# EAGLE design MRCS-SMC-08-Arduino-Relay (EAGLE 7.7.0)
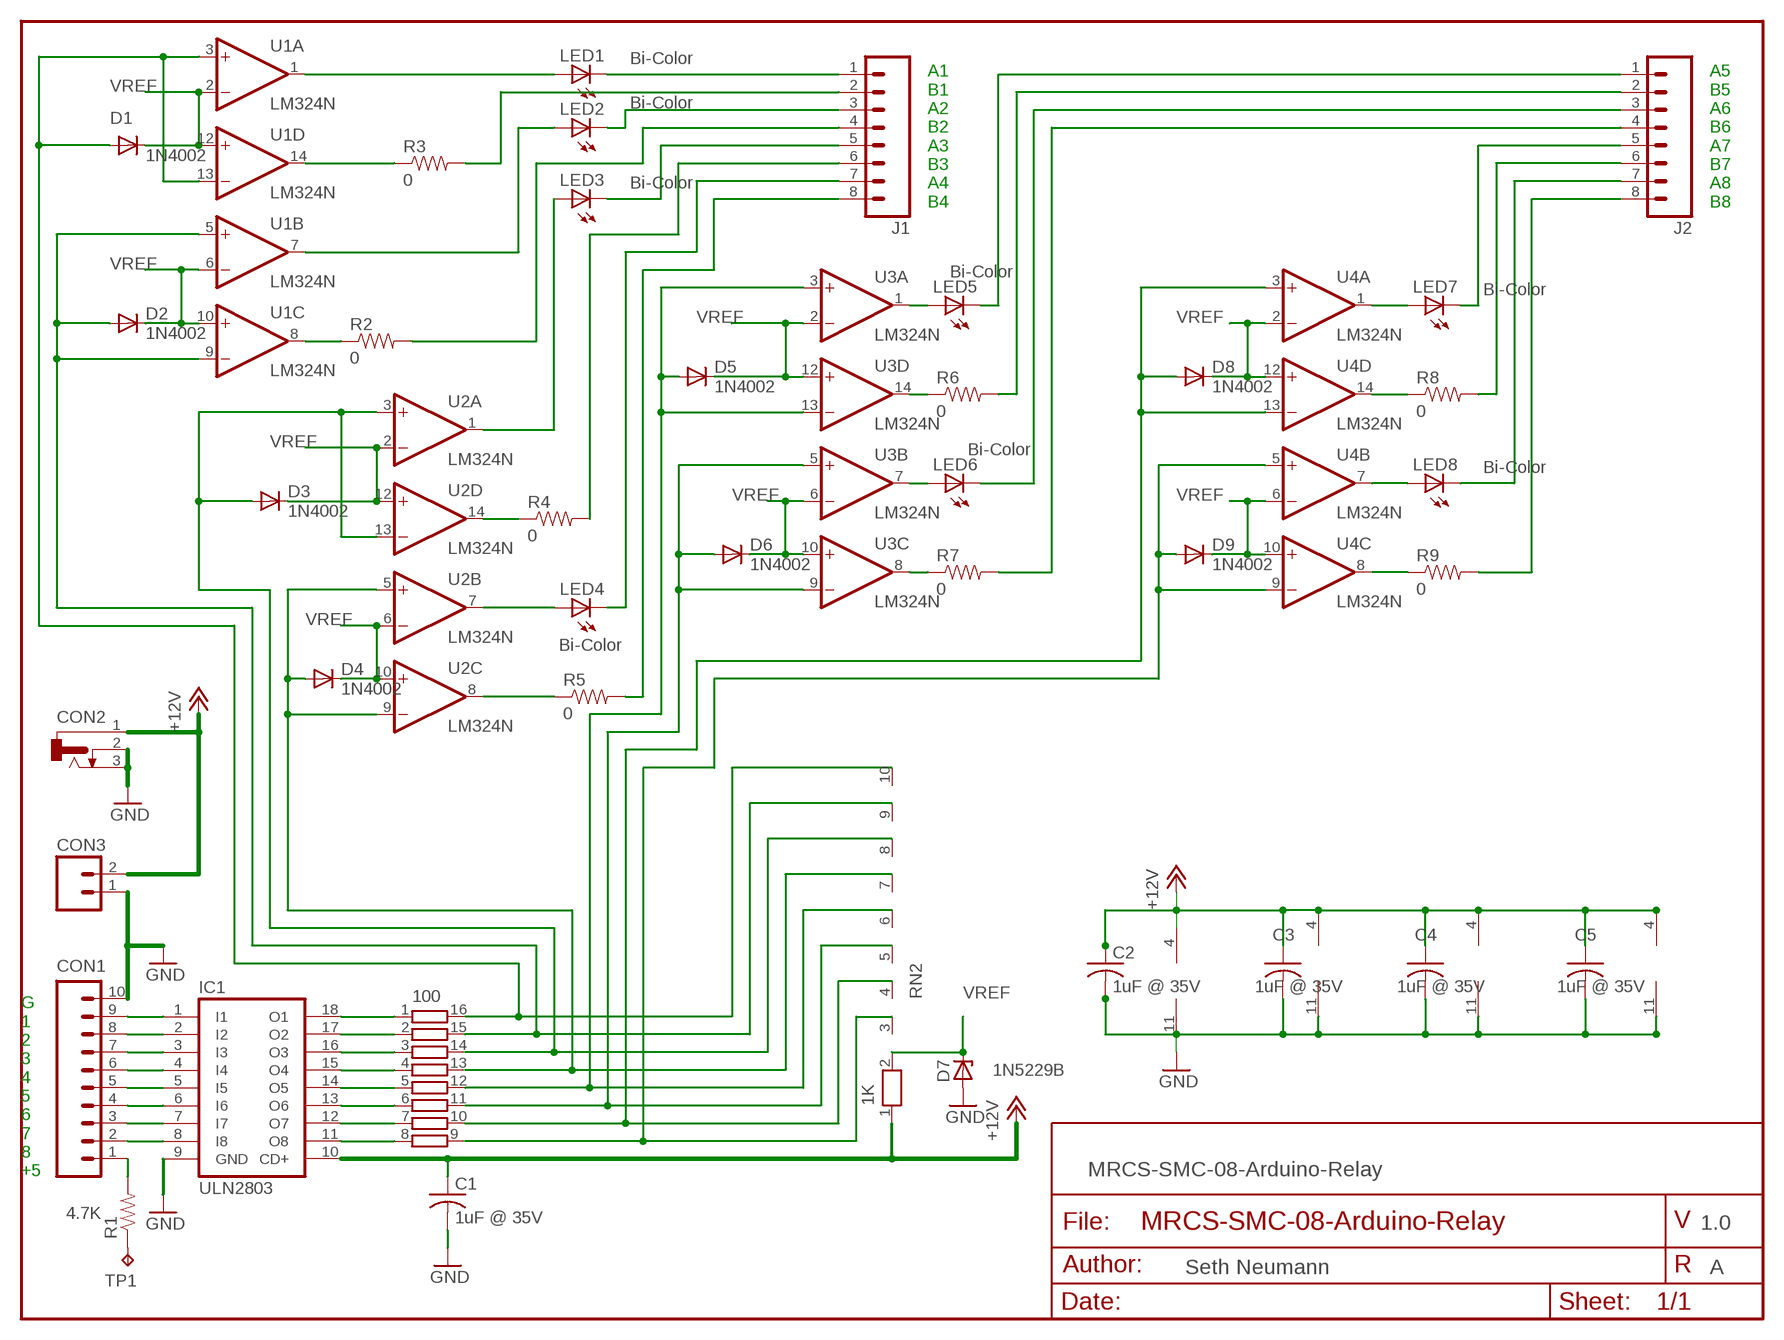
[diagram p0: schematic, sheet 1]

## Parts
C1  1uF @ 35V  CAPPTH2  [C-PTH-0.100]
C2  1uF @ 35V  CAPPTH2  [C-PTH-0.100]
C3  1uF @ 35V  CAPPTH2  [C-PTH-0.100]
C4  1uF @ 35V  CAPPTH2  [C-PTH-0.100]
C5  1uF @ 35V  CAPPTH2  [C-PTH-0.100]
CON1  CONNECTOR-M10LOCK  [1X10_LOCK]
CON2  CONNECTOR-DC-POWER-S  [DCJ0202-SMALL]
CON3  CONNECTOR-M023.5MM-LOCK  [SCREWTERMINAL-3.5MM-2_LOCK]
D1  1N4002  DIODEPTH  [DIODE-1N4001]
D2  1N4002  DIODEPTH  [DIODE-1N4001]
D3  1N4002  DIODEPTH  [DIODE-1N4001]
D4  1N4002  DIODEPTH  [DIODE-1N4001]
D5  1N4002  DIODEPTH  [DIODE-1N4001]
D6  1N4002  DIODEPTH  [DIODE-1N4001]
D7  1N5229B  ZENER-DIODEZD-5  [ZDIO-5]
D8  1N4002  DIODEPTH  [DIODE-1N4001]
D9  1N4002  DIODEPTH  [DIODE-1N4001]
IC1  ULN2803  ULN2803A  [DIL18]
J1  CONNECTOR-M08LOCK  [1X08_LOCK]
J2  CONNECTOR-M08LOCK  [1X08_LOCK]
LED1  Bi-Color  LEDLED3MM  [LED3MM]
LED2  Bi-Color  LEDLED3MM  [LED3MM]
LED3  Bi-Color  LEDLED3MM  [LED3MM]
LED4  Bi-Color  LEDLED3MM  [LED3MM]
LED5  Bi-Color  LEDLED3MM  [LED3MM]
LED6  Bi-Color  LEDLED3MM  [LED3MM]
LED7  Bi-Color  LEDLED3MM  [LED3MM]
LED8  Bi-Color  LEDLED3MM  [LED3MM]
R1  4.7K  RPTH04  [AXIAL-0.4-RES]
R2  0  RPTH-R0  [CUT-R]
R3  0  RPTH-R0  [CUT-R]
R4  0  RPTH-R0  [CUT-R]
R5  0  RPTH-R0  [CUT-R]
R6  0  RPTH-R0  [CUT-R]
R7  0  RPTH-R0  [CUT-R]
R8  0  RPTH-R0  [CUT-R]
R9  0  RPTH-R0  [CUT-R]
RN1  100  8R-N  [DIL16]
RN2  1K  RN09  [RN-10]
TP1  TPPAD1-13  [P1-13]
U1  LM324N  [DIL14]
U2  LM324N  [DIL14]
U3  LM324N  [DIL14]
U4  LM324N  [DIL14]

## Nets
+12V: C1.1 C2.1 C3.1 C4.1 C5.1 CON2.1 CON3.2(B) IC1.10(CD+) RN2.1 U1.4(P:V+) U2.4(P:V+) U3.4(P:V+) U4.4(P:V+)
GND: C1.2 C2.2 C3.2 C4.2 C5.2 CON1.10 CON2.2 CON2.3 CON3.1(A) D7.A IC1.9(GND) U1.11(P:V-) U2.11(P:V-) U3.11(P:V-) U4.11(P:V-)
N$1: R1.P$1 TP1.TP
N$2: CON1.9 IC1.1(I1)
N$3: CON1.8 IC1.2(I2)
N$4: CON1.7 IC1.3(I3)
N$5: CON1.6 IC1.4(I4)
N$6: CON1.5 IC1.5(I5)
N$7: CON1.4 IC1.6(I6)
N$8: CON1.3 IC1.7(I7)
N$9: CON1.2 IC1.8(I8)
N$10: D2.A RN1.15 RN2.9 U1.5(B:+IN) U1.9(C:-IN)
N$11: R3.P2 U1.14(D:OUT)
N$12: CON1.1 R1.P$2
N$13: J1.7 LED4.K(C)
N$14: J1.2 R3.P1
N$15: LED1.A U1.1(A:OUT)
N$16: J1.1 LED1.K(C)
N$17: IC1.18(O1) RN1.1
N$18: IC1.17(O2) RN1.2
N$19: LED2.A U1.7(B:OUT)
N$20: R2.P2 U1.8(C:OUT)
N$21: J1.4 R2.P1
N$22: J1.3 LED2.K(C)
N$23: IC1.16(O3) RN1.3
N$24: IC1.15(O4) RN1.4
N$25: IC1.14(O5) RN1.5
N$26: IC1.13(O6) RN1.6
N$27: IC1.12(O7) RN1.7
N$28: IC1.11(O8) RN1.8
N$29: LED7.A U4.1(A:OUT)
N$30: R8.P2 U4.14(D:OUT)
N$31: D6.A RN1.11 RN2.5 U3.5(B:+IN) U3.9(C:-IN)
N$32: LED5.A U3.1(A:OUT)
N$33: LED4.A U2.7(B:OUT)
N$34: LED3.A U2.1(A:OUT)
N$35: D3.A RN1.14 RN2.8 U2.3(A:+IN) U2.13(D:-IN)
N$36: J1.5 LED3.K(C)
N$37: D1.A RN1.16 RN2.10 U1.3(A:+IN) U1.13(D:-IN)
N$38: R4.P2 U2.14(D:OUT)
N$39: J1.6 R4.P1
N$40: D4.A RN1.13 RN2.7 U2.5(B:+IN) U2.9(C:-IN)
N$41: R5.P2 U2.8(C:OUT)
N$42: J1.8 R5.P1
N$43: R6.P2 U3.14(D:OUT)
N$44: D5.A RN1.12 RN2.6 U3.3(A:+IN) U3.13(D:-IN)
N$45: J2.1 LED5.K(C)
N$46: J2.2 R6.P1
N$47: LED6.A U3.7(B:OUT)
N$48: R7.P2 U3.8(C:OUT)
N$49: J2.3 LED6.K(C)
N$50: J2.4 R7.P1
N$51: LED8.A U4.7(B:OUT)
N$52: J2.6 R8.P1
N$53: D8.A RN1.10 RN2.4 U4.3(A:+IN) U4.13(D:-IN)
N$54: D9.A RN1.9 RN2.3 U4.5(B:+IN) U4.9(C:-IN)
N$55: R9.P2 U4.8(C:OUT)
N$56: J2.5 LED7.K(C)
N$57: J2.7 LED8.K(C)
N$58: J2.8 R9.P1
VREF: D1.C D2.C D3.C D4.C D5.C D6.C D7.C D8.C D9.C RN2.2 U1.2(A:-IN) U1.6(B:-IN) U1.10(C:+IN) U1.12(D:+IN) U2.2(A:-IN) U2.6(B:-IN) U2.10(C:+IN) U2.12(D:+IN) U3.2(A:-IN) U3.6(B:-IN) U3.10(C:+IN) U3.12(D:+IN) U4.2(A:-IN) U4.6(B:-IN) U4.10(C:+IN) U4.12(D:+IN)

## Notes on the sheet
- A1
  B1
  A2
  B2
  A3
  B3
  A4
  B4
- A5
  B5
  A6
  B6
  A7
  B7
  A8
  B8
- G
  1
  2
  3
  4
  5
  6
  7
  8
  +5
- MRCS-SMC-08-Arduino-Relay
- 1.0
- Seth Neumann | A

## Library data of the parts
C1-C5 = SPCoast:CAP*
CON1 = SPCoast:CONNECTOR-M10: Header 10 Standard 10-pin 0.1" header. Use with straight break away headers (SKU : PRT-00116), right angle break away headers (PRT-00553), swiss pins (PRT-00743), machine pins (PRT-00117), and female headers (PRT-00115).
CON2 = SPCoast:CONNECTOR-DC-POWER: DC POWER JACK
CON3 = SPCoast:CONNECTOR-M02: PHOENIX CONNECTOR
D1-D6 D8 D9 = SPCoast:DIODE: Diode These are standard reverse protection diodes and small signal diodes. SMA package can handle up to about 1A. SOD-323 can handle about 200mA. What the SOD-323 package when ordering, there are some mfgs out there that are 5-pin packages.
D7 = SPCoast:ZENER-DIODE: Z-Diode
IC1 = MRCS:ULN2803A: DRIVER ARRAY
J1 J2 = SPCoast:CONNECTOR-M08: Header 8 Standard 8-pin 0.1" header. Use with straight break away headers (SKU : PRT-00116), right angle break away headers (PRT-00553), swiss pins (PRT-00743), machine pins (PRT-00117), and female headers (PRT-00115).
LED1-LED8 = SPCoast:LED*
R1-R9 = SPCoast:R*: Resistor Basic schematic elements and footprints for 0603, 1206, and PTH 1/10th watt (small) resistors.
RN1 = resistor-dil:8R-N: DIL RESISTOR; OC_FARNELL: unknown; OC_NEWARK: unknown
RN2 = MRCS:RN09: RESISTOR NETWORK; OC_FARNELL: unknown; OC_NEWARK: unknown
TP1 = testpad:TP: Test pad
U1-U4 = SPCoast:LM324: OP AMP

## Board
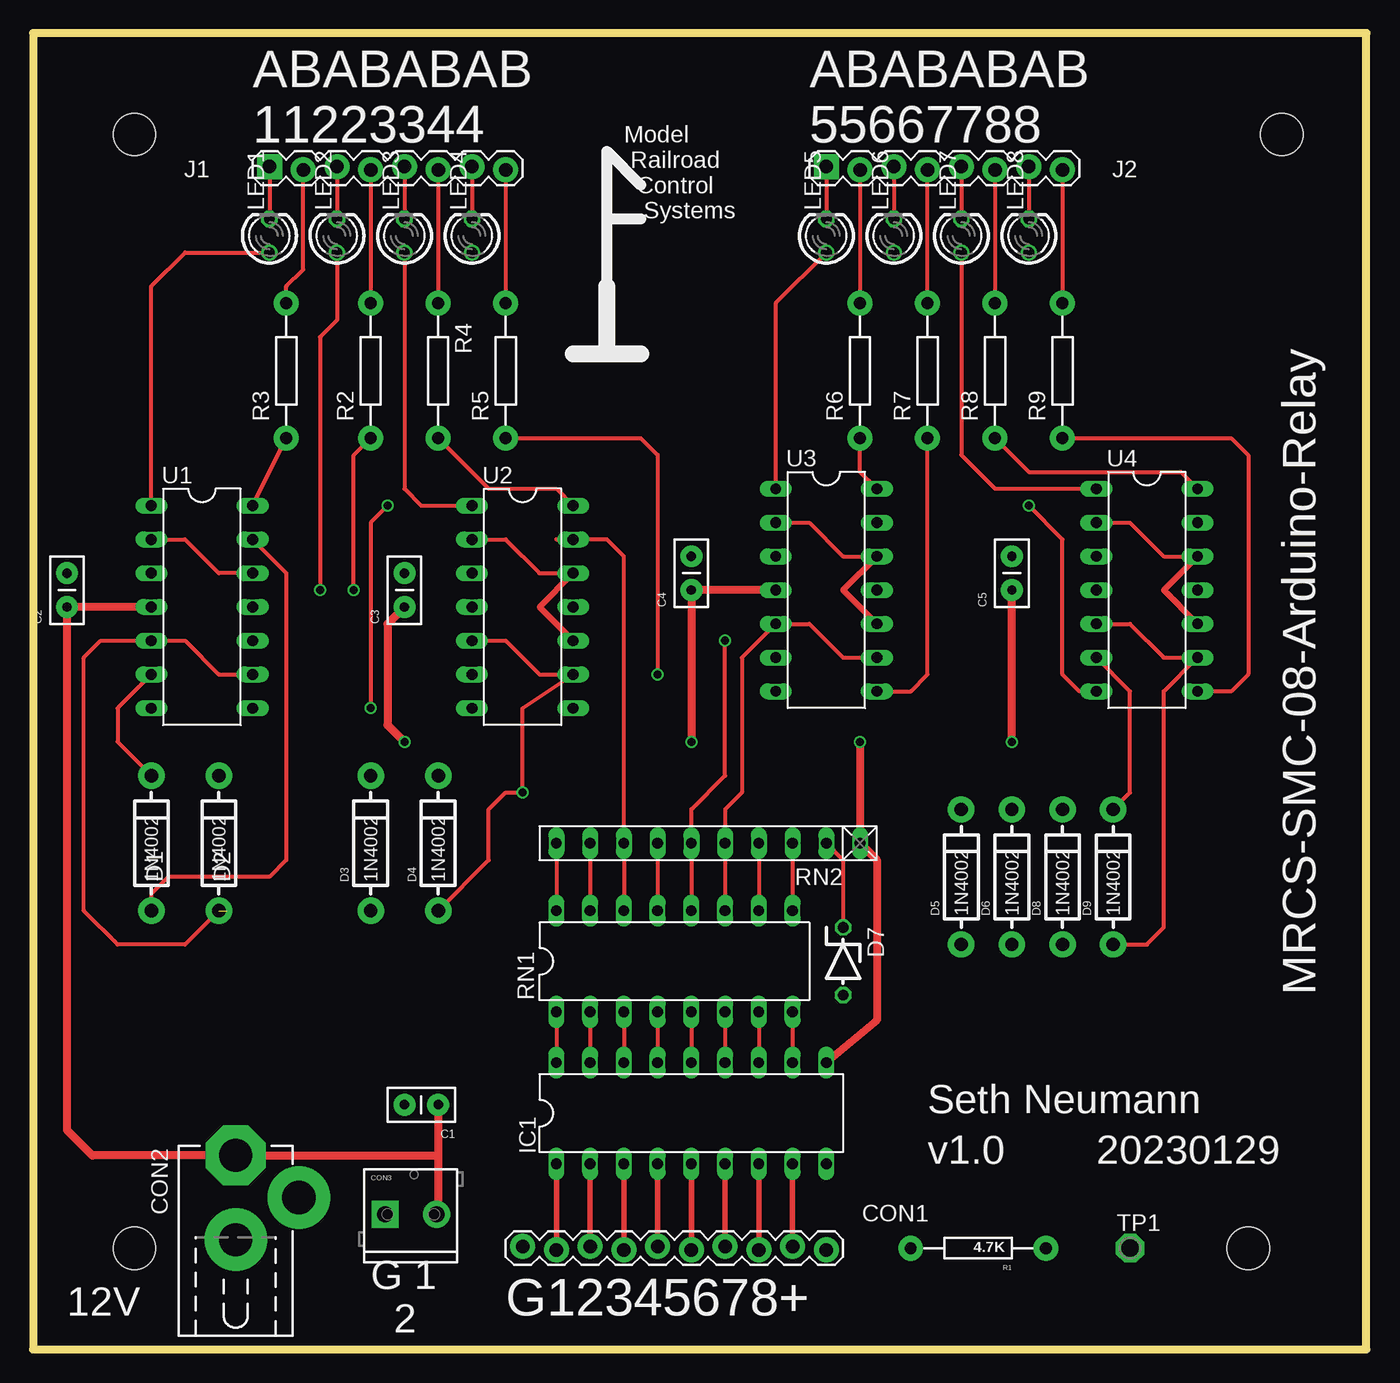
[diagram p1: board, top side]
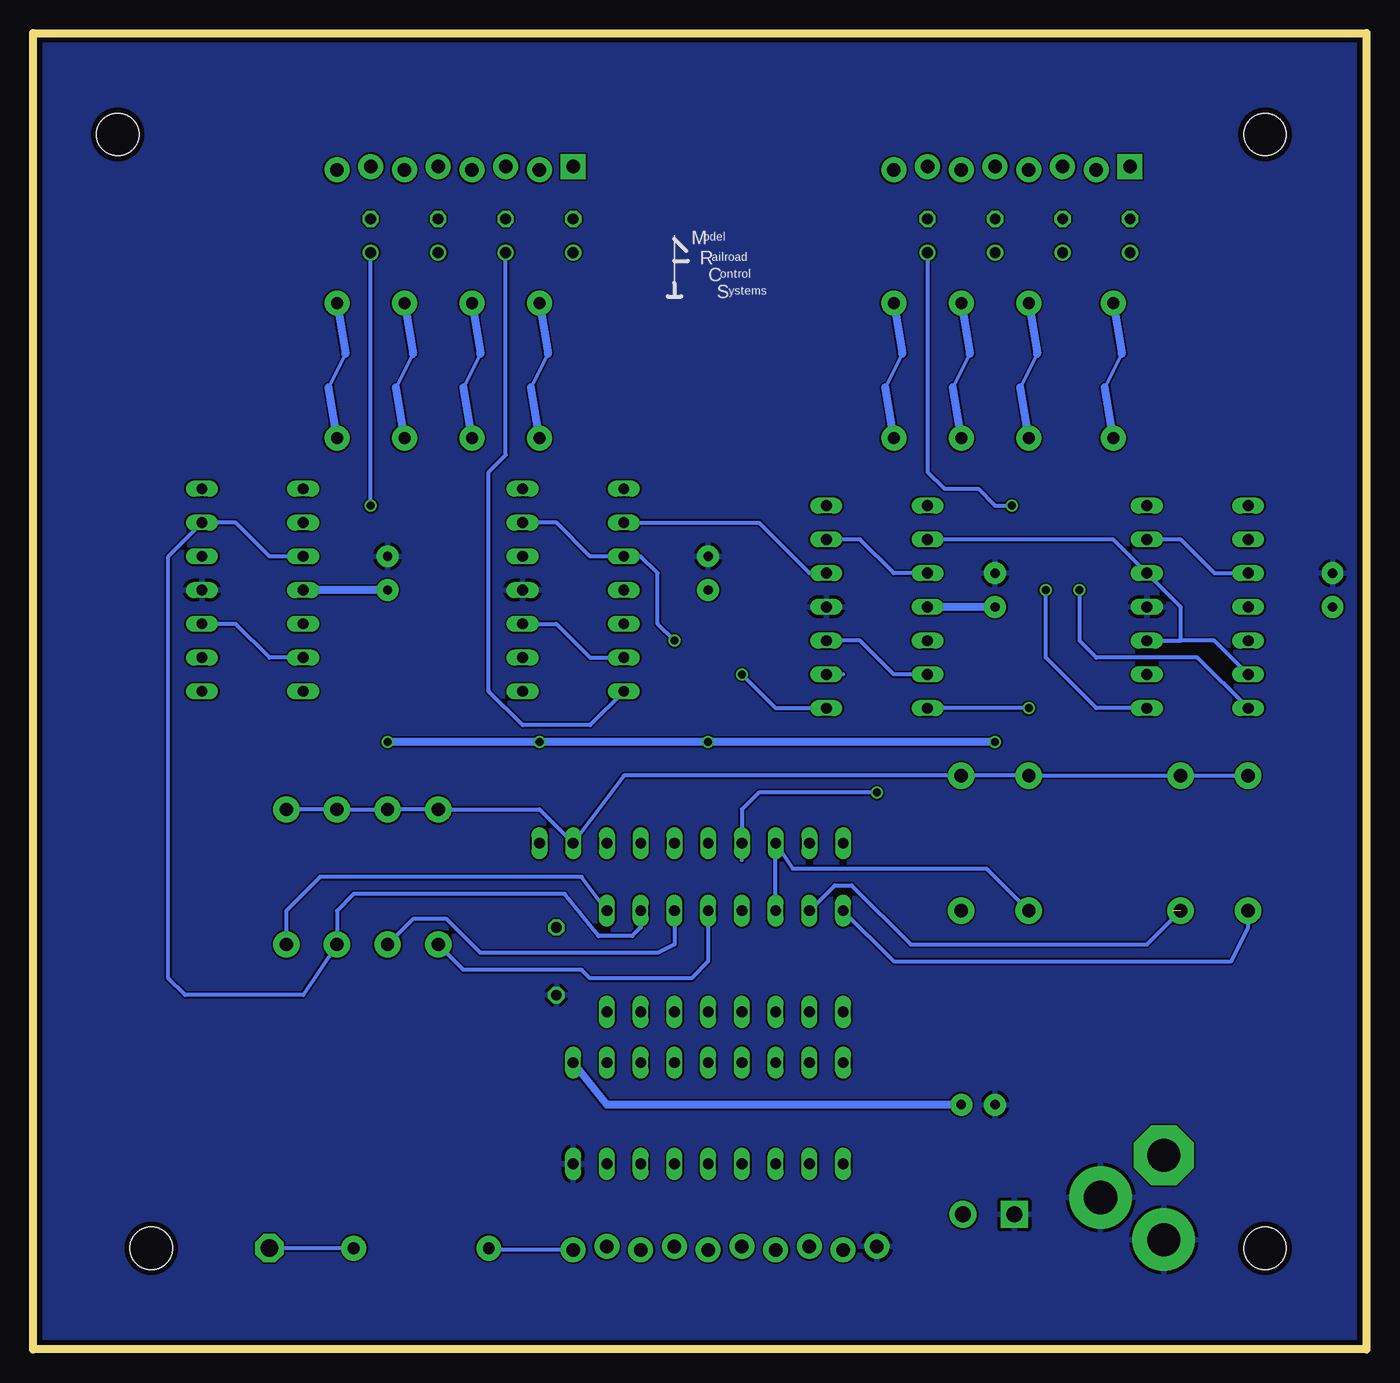
[diagram p2: board, bottom side, seen from below]

Size 100.33 x 99.06 mm. Coordinates in mm from the lower left corner, seen from the top.
Outline: 0,0 100.33,0 100.33,99.06 0,99.06 0,0
Copper layers (1*16): Top 0.035mm / dielectric 1.5mm / Bottom 0.035mm
Design rules "default *": minimum track width 5mil, minimum drill 0.2mm, track to track 5mil, track to pad 5mil, pad to pad 5mil, via to via 5mil, smd to smd 5mil, copper to edge 0.4mm, drill to drill 5mil, minimum pad ring 3mil, minimum via ring 3mil, stop-mask expansion 4mil, vias tented up to drill 0mil, thermal gap 10mil
Holes 3.2 mm at 7.62,91.44 93.98,91.44 91.44,7.62 7.62,7.62

### Footprints (pad centres in the part's own frame; a part is rotated, then mirrored left to right if it is on the bottom)
C-PTH-0.100 = drill 0.7 pad 1.651: 1 -1.27,0; 2 1.27,0
1X10_LOCK = drill 1.016 pad 1.88: 1 0,0.127; 2 2.54,-0.127; 3 5.08,0.127; 4 7.62,-0.127; 5 10.16,0.127; 6 12.7,-0.127; 7 15.24,0.127; 8 17.78,-0.127; 9 20.32,0.127; 10 22.86,-0.127
DCJ0202-SMALL = drill 2.5 pad 4.5 octagon: 1 0,3.175 | drill 2.5 pad 4.7: 2 4.763,0; 3 0,-3.175
SCREWTERMINAL-3.5MM-2_LOCK = drill 1.2 pad 2.032 square: 1 -0.178,0 | drill 1.2 pad 2.032: 2 3.678,0
DIODE-1N4001 = drill 1 pad 1.981: A 5.08,0; C -5.08,0
ZDIO-5 = drill 0.813 octagon: A 2.54,0; C -2.54,0
DIL18 = drill 0.813 long: 1 -10.16,-3.81; 2 -7.62,-3.81; 3 -5.08,-3.81; 4 -2.54,-3.81; 5 0,-3.81; 6 2.54,-3.81; 7 5.08,-3.81; 8 7.62,-3.81; 9 10.16,-3.81; 10 10.16,3.81; 11 7.62,3.81; 12 5.08,3.81; 13 2.54,3.81; 14 0,3.81; 15 -2.54,3.81; 16 -5.08,3.81; 17 -7.62,3.81; 18 -10.16,3.81
1X08_LOCK = drill 1.016 pad 1.88 square: 1 0,0.127 | drill 1.016 pad 1.88: 2 2.54,-0.127; 3 5.08,0.127; 4 7.62,-0.127; 5 10.16,0.127; 6 12.7,-0.127; 7 15.24,0.127; 8 17.78,-0.127
LED3MM = drill 0.813: A 1.27,0 | drill 0.813 octagon: K -1.27,0
AXIAL-0.4-RES = drill 0.9 pad 1.88: P$1 -5.08,0; P$2 5.08,0
CUT-R = drill 0.9 pad 1.88: P1 5.08,0; P2 -5.08,0
DIL16 = drill 0.813 long: 1 -8.89,-3.81; 2 -6.35,-3.81; 3 -3.81,-3.81; 4 -1.27,-3.81; 5 1.27,-3.81; 6 3.81,-3.81; 7 6.35,-3.81; 8 8.89,-3.81; 9 8.89,3.81; 10 6.35,3.81; 11 3.81,3.81; 12 1.27,3.81; 13 -1.27,3.81; 14 -3.81,3.81; 15 -6.35,3.81; 16 -8.89,3.81
RN-10 = drill 0.813 long: 1 -11.43,0; 2 -8.89,0; 3 -6.35,0; 4 -3.81,0; 5 -1.27,0; 6 1.27,0; 7 3.81,0; 8 6.35,0; 9 8.89,0; 10 11.43,0
P1-13 = drill 1.321 pad 2.159 octagon: TP 0,0
DIL14 = drill 0.813 long: 1 -7.62,-3.81; 2 -5.08,-3.81; 3 -2.54,-3.81; 4 0,-3.81; 5 2.54,-3.81; 6 5.08,-3.81; 7 7.62,-3.81; 8 7.62,3.81; 9 5.08,3.81; 10 2.54,3.81; 11 0,3.81; 12 -2.54,3.81; 13 -5.08,3.81; 14 -7.62,3.81

### Placement (x,y rotation side)
C1  29.21,18.41 180 top
C2  2.54,57.15 90 top
C3  27.94,57.15 90 top
C4  49.53,58.42 90 top
C5  73.66,58.42 90 top
CON1  59.69,7.62 180 top
CON2  15.24,11.43 0 top
CON3  26.67,10.16 0 top
D1  8.89,38.1 270 top
D2  13.97,38.1 270 top
D3  25.4,38.1 270 top
D4  30.48,38.1 270 top
D5  69.85,35.56 270 top
D6  73.66,35.56 270 top
D7  60.96,29.21 270 top
D8  77.47,35.56 270 top
D9  81.28,35.56 270 top
IC1  49.53,17.78 0 top
J1  17.78,88.9 0 top
J2  59.69,88.9 0 top
LED1  17.78,83.82 270 top
LED2  22.86,83.82 270 top
LED3  27.94,83.82 270 top
LED4  33.02,83.82 270 top
LED5  59.69,83.82 270 top
LED6  64.77,83.82 270 top
LED7  69.85,83.82 270 top
LED8  74.93,83.82 270 top
R1  71.12,7.62 180 top
R2  25.4,73.66 90 top
R3  19.05,73.66 90 top
R4  30.48,73.66 90 top
R5  35.56,73.66 90 top
R6  62.23,73.66 90 top
R7  67.31,73.66 90 top
R8  72.39,73.66 90 top
R9  77.47,73.66 90 top
RN1  48.26,29.21 0 top
RN2  50.8,38.1 180 top
TP1  82.55,7.62 0 top
U1  12.7,55.88 270 top
U2  36.83,55.88 270 top
U3  59.69,57.15 270 top
U4  83.82,57.15 270 top
U$1  [MRCS-LOGO-LARGE]  43.18,81.28 0 top
U$2  [MRCSLOGOBTM]  45.72,78.74 0 top

### Tracks (layer width: path | path; a pad name or v marks a point on that pad's centre or on a via)
+12V  (via drill 0.6)
  Top 0.61: 30.48,14.61 CON2.1 4.45,14.61 2.54,16.51 C2.1 U1.4 | 30.48,14.61 30.48,10.29 CON3.2 | C1.1 30.48,14.61 | IC1.10 63.5,24.77 63.5,36.83 RN2.1 v62.23,45.72 | C3.1 26.67,54.61 26.67,46.99 v27.94,45.72 | U3.4 C4.1 v49.53,45.72 | v73.66,45.72 C5.1
  Bottom 0.61: C1.1 57.15,18.41 IC1.10 | v27.94,45.72 v49.53,45.72 v62.23,45.72 v73.66,45.72 | C3.1 U2.4 | C5.1 U4.4
GND
  pour Bottom: 0,0 100.33,0 100.33,99.06 0,99.06
N$1
  Bottom 0.305: R1.P$1 TP1.TP
N$2
  Top 0.406: CON1.9 IC1.1
N$3
  Top 0.406: CON1.8 IC1.2
N$4
  Top 0.406: CON1.7 IC1.3
N$5
  Top 0.406: CON1.6 IC1.4
N$6
  Top 0.406: CON1.5 IC1.5
N$7
  Top 0.406: CON1.4 IC1.6
N$8
  Top 0.406: CON1.3 IC1.7
N$9
  Top 0.406: CON1.2 IC1.8
N$10  (1 unrouted)
  Top 0.305: D2.A 11.43,30.48 6.35,30.48 3.81,33.02 3.81,52.07 5.08,53.34 U1.5 11.43,53.34 13.97,50.8 U1.9 | RN2.9 RN1.15
  Bottom 0.305: RN1.15 40.01,34.92 38.73,34.92 34.29,30.48 16.51,30.48 14.61,32.38 14.61,33.02
N$11
  Top 0.305: U1.14 R3.P2
N$12
  Bottom 0.305: CON1.1 65.91,7.49 R1.P$2
N$13
  Top 0.305: J1.7 LED4.K
N$14
  Top 0.305: R3.P1 19.05,80.01 20.32,81.28 J1.2
N$15
  Top 0.305: U1.1 8.89,80.01 11.43,82.55 LED1.A
N$16
  Top 0.305: J1.1 LED1.K
N$17
  Top 0.305: RN1.1 IC1.18
N$18
  Top 0.305: RN1.2 IC1.17
N$19  (via drill 0.6)
  Top 0.305: LED2.A 22.86,77.47 21.59,76.2 v21.59,57.15
  Bottom 0.305: U1.7 12.7,52.07 20.32,52.07 21.59,53.34 v21.59,57.15
N$20  (via drill 0.6)
  Top 0.305: v24.13,57.15 24.13,67.31 R2.P2
  Bottom 0.305: U1.8 20.32,48.26 24.13,52.07 v24.13,57.15
N$21
  Top 0.305: J1.4 R2.P1
N$22
  Top 0.305: J1.3 LED2.K
N$23
  Top 0.305: RN1.3 IC1.16
N$24
  Top 0.305: RN1.4 IC1.15
N$25
  Top 0.305: RN1.5 IC1.14
N$26
  Top 0.305: RN1.6 IC1.13
N$27
  Top 0.305: RN1.7 IC1.12
N$28
  Top 0.305: RN1.8 IC1.11
N$29
  Top 0.305: LED7.A 69.85,67.31 72.39,64.77 U4.1
N$30
  Top 0.305: R8.P2 74.93,66.04 86.36,66.04 U4.14
N$31
  Top 0.305: RN1.11 RN2.5 52.07,40.64 53.34,41.91 53.34,52.07 U3.5 58.42,54.61 60.96,52.07 U3.9
  Bottom 0.305: RN1.11 52.07,30.48 53.34,29.84 66.67,29.84 69.22,32.38 71.75,32.38 D6.A
N$32
  Top 0.305: LED5.A 55.88,78.74 U3.1
N$33  (via drill 0.6)
  Top 0.305: v26.67,63.5 25.4,62.23 v25.4,48.26
  Bottom 0.305: LED4.A 33.02,66.04 31.75,64.77 29.21,64.77 27.94,63.5 v26.67,63.5 | v25.4,48.26 U2.7
N$34
  Top 0.305: LED3.A 27.94,64.77 29.21,63.5 U2.1
N$35
  Top 0.305: RN1.14 RN2.8 44.45,59.69 43.18,60.96 U2.13 39.37,60.96
  Bottom 0.305: U2.3 35.56,58.42 38.1,60.96 U2.13 | RN1.14 RN2.8 43.18,36.2 28.57,36.2 D3.A
N$36
  Top 0.305: J1.5 LED3.K
N$37
  Top 0.305: U1.13 19.05,58.42 19.05,36.83 17.78,35.56 10.16,35.56 8.89,34.29 D1.A | RN2.10 RN1.16
  Bottom 0.305: U1.3 11.43,58.42 13.97,60.96 U1.13 | D1.A 8.89,31.75 10.16,29.21 35.56,29.21 RN1.16
N$38
  Top 0.305: U2.14 39.37,64.77 34.29,64.77 R4.P2
N$39
  Top 0.305: J1.6 R4.P1
N$40  (via drill 0.6)
  Top 0.305: RN2.7 RN1.13 | D4.A 34.29,36.83 34.29,40.64 35.56,41.91 v36.83,41.91 36.83,48.26 U2.9 38.1,50.8 35.56,53.34 U2.5
  Bottom 0.305: 46.99,36.83 RN2.7 46.99,40.64 45.72,41.91 v36.83,41.91 | 39.37,50.8 U2.9
N$41  (via drill 0.6)
  Top 0.305: R5.P2 45.72,68.58 46.99,67.31 v46.99,50.8
  Bottom 0.305: v46.99,50.8 44.45,48.26 U2.8
N$42
  Top 0.305: J1.8 R5.P1
N$43
  Top 0.305: U3.14 62.23,66.04 R6.P2
N$44  (via drill 0.6)
  Top 0.305: RN1.12 RN2.6 49.53,40.64 52.07,43.18 v52.07,53.34
  Bottom 0.305: v52.07,53.34 53.34,54.61 53.34,58.42 54.61,59.69 U3.3 58.42,59.69 60.96,62.23 U3.13 | RN1.12 49.53,29.21 50.8,27.94 58.42,27.94 59.05,28.57 67.94,28.57 D5.A
N$45
  Top 0.305: J2.1 LED5.K
N$46
  Top 0.305: J2.2 R6.P1
N$47
  Bottom 0.305: U3.7 58.42,46.99 63.5,46.99 66.04,49.53 66.04,66.04 64.77,67.31 LED6.A
N$48
  Top 0.305: R7.P2 67.31,50.8 66.04,49.53 U3.8
N$49
  Top 0.305: J2.3 LED6.K
N$50
  Top 0.305: R7.P1 J2.4
N$51  (via drill 0.6)
  Top 0.305: U4.7 78.74,49.53 77.47,50.8 77.47,60.96 v74.93,63.5
  Bottom 0.305: v74.93,63.5 LED8.A
N$52
  Top 0.305: J2.6 R8.P1
N$53
  Top 0.305: RN2.4 RN1.10
  Bottom 0.305: RN1.10 54.61,31.75 55.24,31.11 57.78,31.11 60.33,34.29 76.2,34.29 77.47,33.02 D8.A 80.01,26.67 88.9,26.67 90.17,27.94 90.17,59.69 U4.13 85.09,62.23 82.55,59.69 U4.3
N$54
  Top 0.305: RN2.3 RN1.9 | U4.5 82.55,54.61 85.09,52.07 U4.9 85.09,49.53 85.09,33.02 85.09,31.75 83.82,30.48 D9.A
  Bottom 0.305: RN1.9 59.05,35.56 78.74,35.56 81.28,33.02 D9.A
N$55
  Top 0.305: R9.P2 90.17,68.58 91.44,67.31 91.44,50.8 90.17,49.53 U4.8
N$56
  Top 0.305: J2.5 LED7.K
N$57
  Top 0.305: J2.7 LED8.K
N$58
  Top 0.305: J2.8 R9.P1
VREF
  Top 0.305: U1.2 11.43,60.96 13.97,58.42 U1.12 | U1.6 6.35,48.26 6.35,45.72 D1.C | U2.2 35.56,60.96 38.1,58.42 U2.12 | RN2.2 60.96,36.83 D7.C | U3.2 58.42,62.23 60.96,59.69 U3.12 | U4.2 82.55,62.23 85.09,59.69 U4.12 | D9.C 82.55,41.91 82.55,49.53 U4.6
  Top 0.406: U2.12 38.1,55.88 U2.10 | U3.12 60.96,57.15 U3.10 | U4.12 85.09,57.15 U4.10
  Bottom 0.305: 13.97,53.34 13.97,55.88 U1.12 19.05,60.96 U2.2 | D1.C D2.C D3.C D4.C 55.88,43.18 RN2.2 62.23,40.64 D5.C D6.C D8.C D9.C | U2.6 35.56,50.8 38.1,53.34 U2.10 | U3.2 45.72,62.23 41.91,58.42 U2.12 | U3.10 60.96,54.61 58.42,52.07 U3.6 | U4.6 82.55,52.07 85.09,54.61 U4.10 | U1.6 11.43,53.34 13.97,53.34 | U1.10 13.97,53.34

### Text on the board
tPlace: ABABABAB / 11223344 | ABABABAB / 55667788 | Seth Neumann | v1.0 | 20230129 | 12V | G12345678+ | G 1 / 2